# EAGLE design mosquino (EAGLE 6.2)
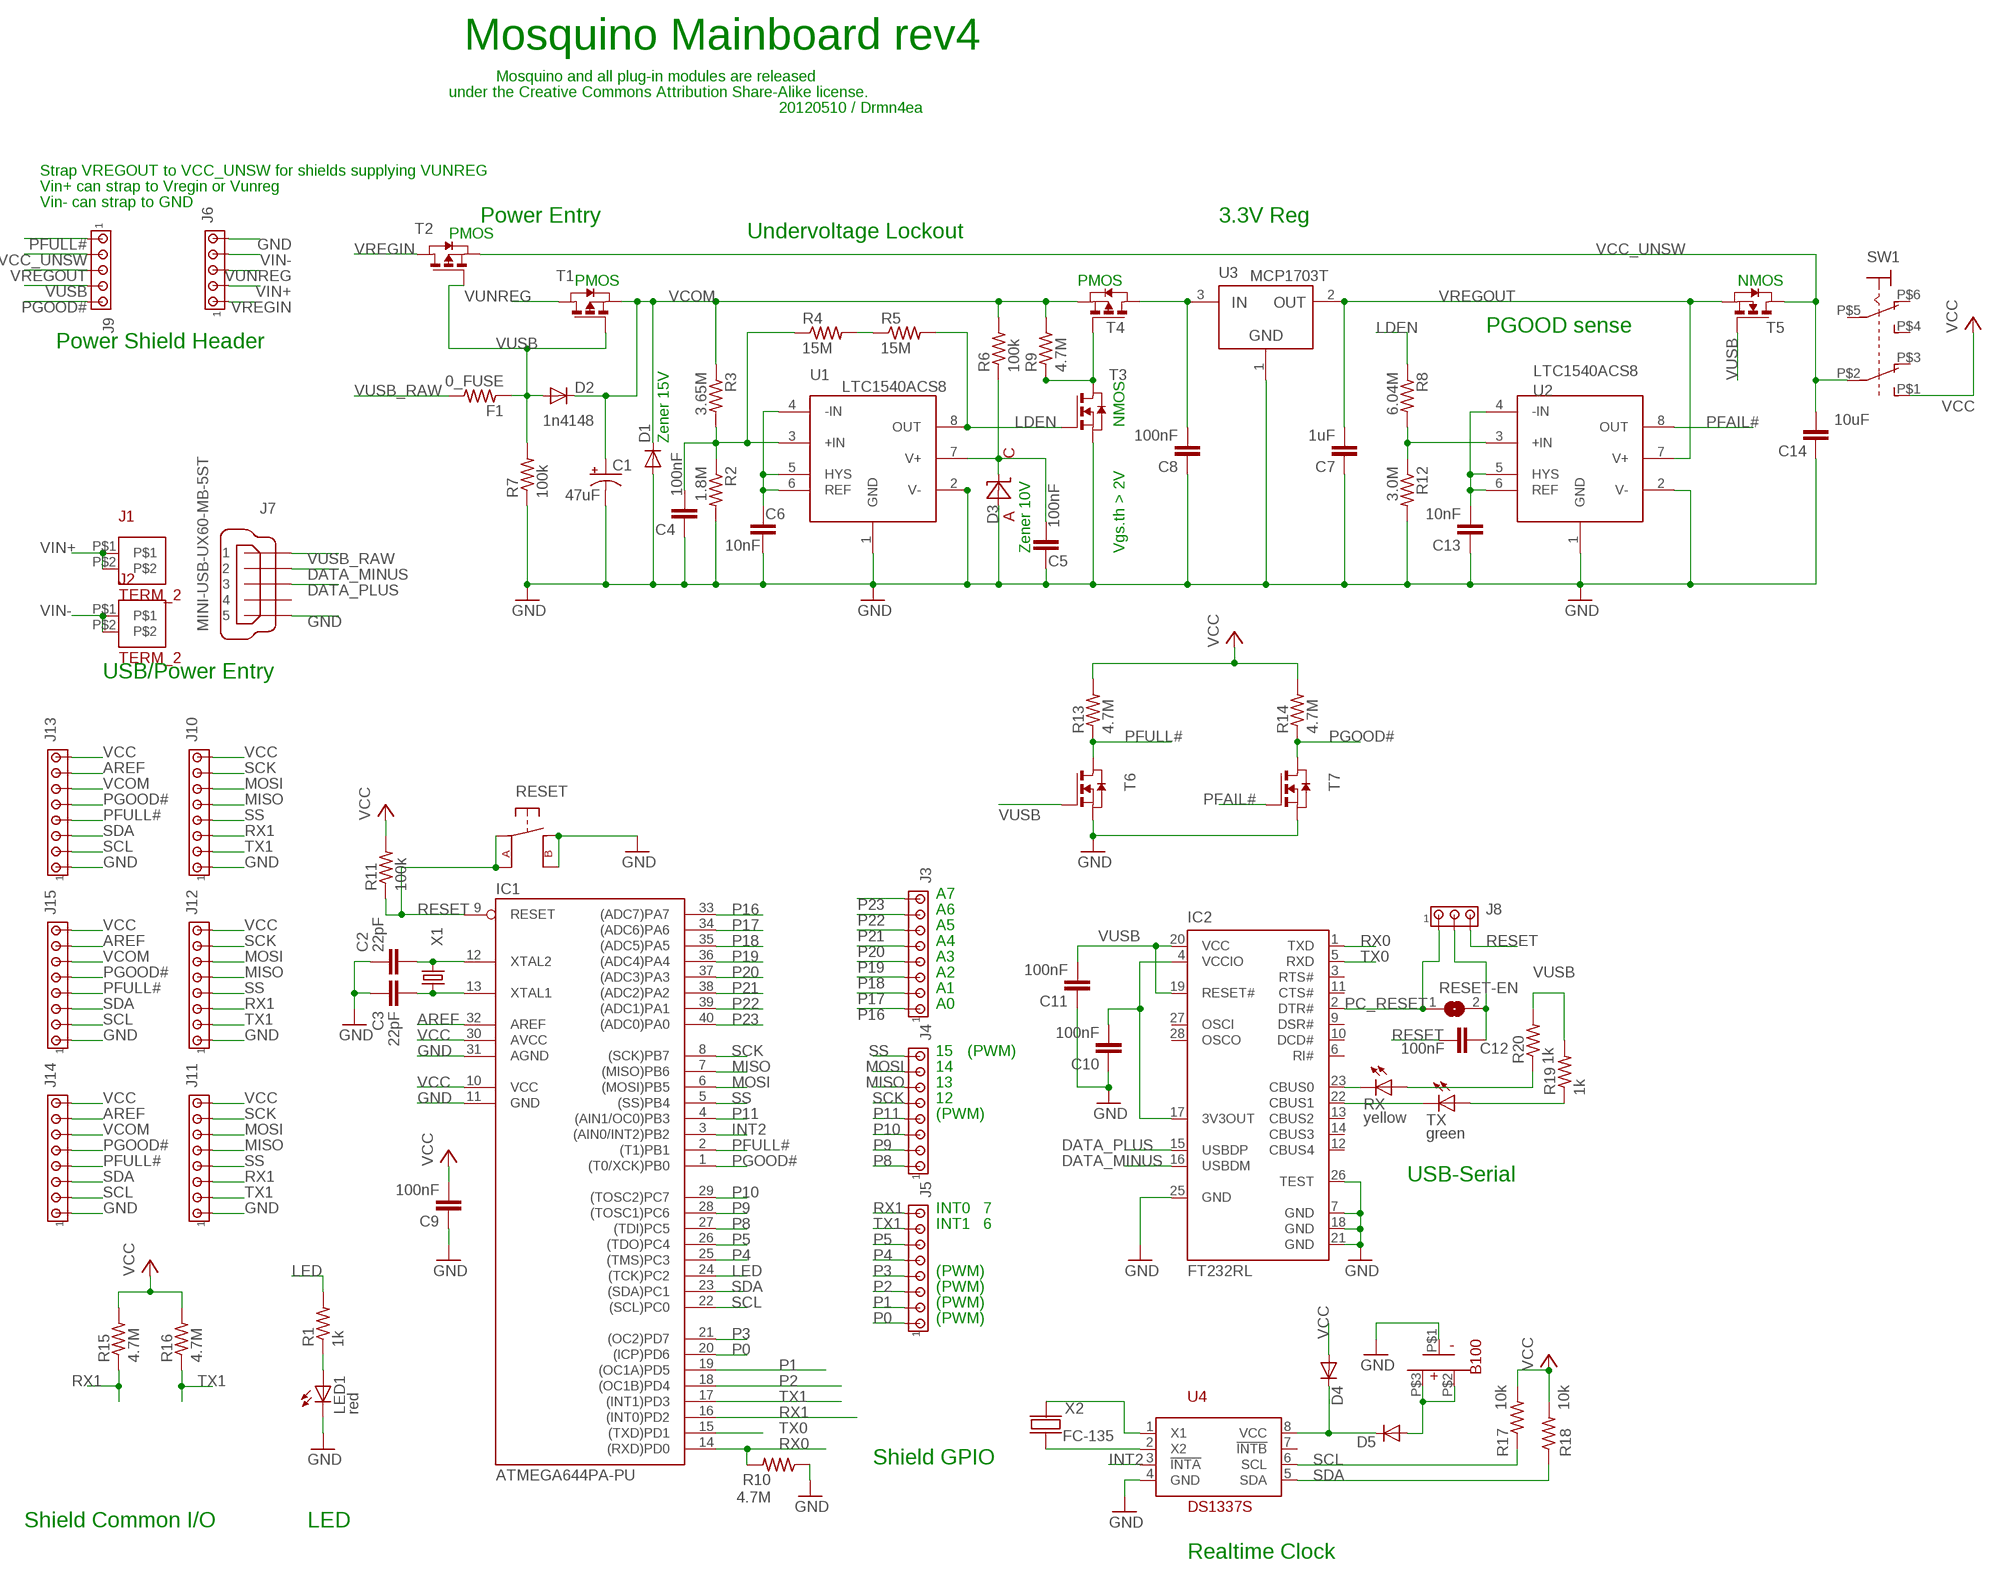
[diagram p0: schematic, sheet 1]

## Parts
B100  BK885_CR1225_COIN_BATTERY_HOLDER_SMD  [BK885_CR1225_COIN_BATTERY_HOLDER_SMD]
C1  47uF  CPOL-USD  [PANASONIC_D]
C2  22pF  C-EUC0805K  [C0805K]
C3  22pF  C-EUC0805K  [C0805K]
C4  100nF  C-EUC0805  [C0805]
C5  100nF  C-EUC0805  [C0805]
C6  10nF  C-EUC0805  [C0805]
C7  1uF  C-EUC0805  [C0805]
C8  100nF  C-EUC0805  [C0805]
C9  100nF  C-EUC0805K  [C0805K]
C10  100nF  C-EUC0805K  [C0805K]
C11  100nF  C-EUC0805K  [C0805K]
C12  100nF  C-EUC0805K  [C0805K]
C13  10nF  C-EUC0805  [C0805]
C14  10uF  C-EUC0805K  [C0805K]
D1  BZT52C15-7-F  DIODE-SOD123  [SOD123]
D2  1n4148  DIODE-SOD123  [SOD123]
D3  BZT52C10-7-F  DIODE_ZENER_CZRM27C200P-G  [SOD123]
D4  MMSD301T1G  DIODE-SOD123  [SOD123]
D5  MMSD301T1G  DIODE-SOD123  [SOD123]
F1  0_FUSE  R-US_R0805  [R0805]
IC1  ATMEGA644PA-PU  MEGA323-P  [DIL40]
IC2  FT232RL  [SSOP28]
J1  TERM_2  [TERM_3POINT5MM]
J2  TERM_2  [TERM_3POINT5MM]
J3  MTA08-100  [10X08MTA]
J4  MTA08-100  [10X08MTA]
J5  MTA08-100  [10X08MTA]
J6  MTA05-100  [10X05MTA]
J7  MINI-USB-UX60-MB-5ST  [UX60-MB-5ST]
J8  MTA03-100  [10X03MTA]
J9  MTA05-100  [10X05MTA]
J10  MTA08-100  [10X08MTA]
J11  MTA08-100  [10X08MTA]
J12  MTA08-100  [10X08MTA]
J13  MTA08-100  [10X08MTA]
J14  MTA08-100  [10X08MTA]
J15  MTA08-100  [10X08MTA]
LED1  red  LEDCHIP-LED0805  [CHIP-LED0805]
R1  1k  R-US_R0805  [R0805]
R2  1.8M  R-US_R0805  [R0805]
R3  3.65M  R-US_R0805  [R0805]
R4  15M  R-US_R0805  [R0805]
R5  15M  R-US_R0805  [R0805]
R6  100k  R-US_R0805  [R0805]
R7  100k  R-US_R0805  [R0805]
R8  6.04M  R-US_R0805  [R0805]
R9  4.7M  R-US_R0805  [R0805]
R10  4.7M  R-US_R0805  [R0805]
R11  100k  R-US_R0805  [R0805]
R12  3.0M  R-US_R0805  [R0805]
R13  4.7M  R-US_R0805  [R0805]
R14  4.7M  R-US_R0805  [R0805]
R15  4.7M  R-US_R0805  [R0805]
R16  4.7M  R-US_R0805  [R0805]
R17  10k  R-US_R0805  [R0805]
R18  10k  R-US_R0805  [R0805]
R19  1k  R-US_R0805  [R0805]
R20  1k  R-US_R0805  [R0805]
RESET  EVQ_TACT_SW_6X6POINT5  [EVQ_TACT_SW_6X6POINT5]
RESET-EN  SJ  [SJ]
RX  yellow  LEDCHIP-LED0805  [CHIP-LED0805]
SW1  SW_DPDT_EG1390  [EG1390_SWITCH_DPDT]
T1  DMP3098L-7  PMOSSOT23  [SOT-23]
T2  DMP3098L-7  PMOSSOT23  [SOT-23]
T3  IRFML8244TRPBF  NMOSSOT23  [SOT-23]
T4  DMP3098L-7  PMOSSOT23  [SOT-23]
T5  BSH103  NMOSSOT23  [SOT-23]
T6  IRFML8244TRPBF  NMOSSOT23  [SOT-23]
T7  IRFML8244TRPBF  NMOSSOT23  [SOT-23]
TX  green  LEDCHIP-LED0805  [CHIP-LED0805]
U1  LTC1540ACS8  [SO-8]
U2  LTC1540ACS8  [SO-8]
U3  MCP1703T  MCP1700T  [SOT23]
U4  DS1337S  [SO-8]
X1  ABLS-4.000MHZ-B4-T  CRYSTALSM49  [SM49]
X2  FC-135  [FC-135]

## Nets
AREF: IC1.32(AREF) J13.7 J14.7 J15.7
DATA_MINUS: IC2.16(USBDM) J7.2
DATA_PLUS: IC2.15(USBDP) J7.3
GND [pwr]: B100.P$1(-) C1.- C2.2 C3.1 C4.1 C5.1 C6.1 C7.1 C8.1 C9.1 C10.1 C11.1 C13.1 C14.1 D1.A D3.A IC1.11(GND) IC1.31(AGND) IC2.7(GND) IC2.18(GND) IC2.21(GND) IC2.25(GND) IC2.26(TEST) J6.5 J7.5 J10.1 J11.1 J12.1 J13.1 J14.1 J15.1 LED1.C R2.2 R7.1 R10.1 R12.2 RESET.B RESET.B2(B1) T3.2(S) T6.2(S) T7.2(S) U1.1(GND) U1.2(V-) U2.1(GND) U2.2(V-) U3.1(GND) U4.4(GND)
INT2: IC1.3((AIN0/INT2)PB2) U4.3(!INTA)
LDEN: R5.2 R8.1 T3.3(G) U1.8(OUT)
LED: IC1.24((TCK)PC2) R1.2
MISO: IC1.7((MISO)PB6) J4.6 J10.5 J11.5 J12.5
MOSI: IC1.6((MOSI)PB5) J4.7 J10.6 J11.6 J12.6
N$1: C12.1 J8.2 RESET-EN.2
N$2: C2.1 IC1.12(XTAL2) X1.2
N$3: LED1.A R1.1
N$4: IC2.22(CBUS1) TX.C
N$5: C3.2 IC1.13(XTAL1) X1.1
N$6: U4.2(X2) X2.P$2(X2)
N$7: D4.C D5.C U4.8(VCC)
N$8: U4.1(X1) X2.P$1(X1)
N$9: C10.2 IC2.4(VCCIO) IC2.17(3V3OUT)
N$10: R20.1 RX.A
N$11: C5.2 D3.C R6.1 U1.7(V+)
N$12: C6.2 U1.4(-IN) U1.5(HYS) U1.6(REF)
N$13: IC2.23(CBUS0) RX.C
N$14: R19.1 TX.A
N$15: B100.P$2(+) B100.P$3(+) D5.A
N$16: C4.2 R2.1 R3.2 R4.1 U1.3(+IN)
N$18: C13.2 U2.4(-IN) U2.5(HYS) U2.6(REF)
N$19: R8.2 R12.1 U2.3(+IN)
N$20 [pwr]: C8.2 T4.1(D) U3.3(IN)
N$21: R9.1 T3.1(D) T4.3(G)
N$22: R4.2 R5.1
P0: IC1.20((ICP)PD6) J5.1
P1: IC1.19((OC1A)PD5) J5.2
P2: IC1.18((OC1B)PD4) J5.3
P3: IC1.21((OC2)PD7) J5.4
P4: IC1.25((TMS)PC3) J5.5
P5: IC1.26((TDO)PC4) J5.6
P8: IC1.27((TDI)PC5) J4.1
P9: IC1.28((TOSC1)PC6) J4.2
P10: IC1.29((TOSC2)PC7) J4.3
P11: IC1.4((AIN1/OC0)PB3) J4.4
P16: IC1.33((ADC7)PA7) J3.1
P17: IC1.34((ADC6)PA6) J3.2
P18: IC1.35((ADC5)PA5) J3.3
P19: IC1.36((ADC4)PA4) J3.4
P20: IC1.37((ADC3)PA3) J3.5
P21: IC1.38((ADC2)PA2) J3.6
P22: IC1.39((ADC1)PA1) J3.7
P23: IC1.40((ADC0)PA0) J3.8
PC_RESET: IC2.2(DTR#) J8.1 RESET-EN.1
PFAIL#: T7.3(G) U2.8(OUT)
PFULL#: IC1.2((T1)PB1) J9.1 J13.4 J14.4 J15.4 R13.1 T6.1(D)
PGOOD#: IC1.1((T0/XCK)PB0) J9.5 J13.5 J14.5 J15.5 R14.1 T7.1(D)
RESET: C12.2 IC1.9(RESET) J8.3 R11.1 RESET.A RESET.A2(A1)
RX0: IC1.14((RXD)PD0) IC2.1(TXD) R10.2
RX1: IC1.16((INT0)PD2) J5.8 J10.3 J11.3 J12.3 R15.1
SCK: IC1.8((SCK)PB7) J4.5 J10.7 J11.7 J12.7
SCL: IC1.22((SCL)PC0) J13.2 J14.2 J15.2 R17.1 U4.6(SCL)
SDA: IC1.23((SDA)PC1) J13.3 J14.3 J15.3 R18.1 U4.5(SDA)
SS: IC1.5((SS)PB4) J4.8 J10.4 J11.4 J12.4
TX0: IC1.15((TXD)PD1) IC2.5(RXD)
TX1: IC1.17((INT1)PD3) J5.7 J10.2 J11.2 J12.2 R16.1
VCC [pwr]: C9.2 D4.A IC1.10(VCC) IC1.30(AVCC) J10.8 J11.8 J12.8 J13.8 J14.8 J15.8 R11.2 R13.2 R14.2 R15.2 R16.2 R17.2 R18.2 SW1.P$1(ON1)
VCC_UNSW [pwr]: C14.2 J9.2 SW1.P$2(COM1) T2.2(S) T5.1(D)
VCOM [pwr]: C1.+ D1.C D2.C J13.6 J14.6 J15.6 R3.1 R6.2 R9.2 T1.2(S) T4.2(S)
VIN+: J1.P$1 J1.P$2 J6.2
VIN-: J2.P$1 J2.P$2 J6.4
VREGIN [pwr]: J6.1 T2.1(D)
VREGOUT [pwr]: C7.2 J9.3 T5.2(S) U2.7(V+) U3.2(OUT)
VUNREG [pwr]: J6.3 T1.1(D)
VUSB [pwr]: C11.2 D2.A F1.1 IC2.19(RESET#) IC2.20(VCC) J9.4 R7.2 R19.2 R20.2 T1.3(G) T2.3(G) T5.3(G) T6.3(G)
VUSB_RAW: F1.2 J7.1
Unconnected: IC2.3(RTS#) IC2.6(RI#) IC2.9(DSR#) IC2.10(DCD#) IC2.11(CTS#) IC2.12(CBUS4) IC2.13(CBUS2) IC2.14(CBUS3) IC2.27(OSCI) IC2.28(OSCO) J7.4 SW1.P$3(OFF1) SW1.P$4(ON2) SW1.P$5(COM2) SW1.P$6(OFF2) U4.7(!INTB)

## Notes on the sheet
- Mosquino Mainboard rev4
- Mosquino and all plug-in modules are released
- under the Creative Commons Attribution Share-Alike license.
- 20120510 / Drmn4ea
- Strap VREGOUT to VCC_UNSW for shields supplying VUNREG
- Vin+ can strap to Vregin or Vunreg
- Vin- can strap to GND
- Power Entry | 3.3V Reg
- PMOS | Undervoltage Lockout
- PMOS | PMOS | NMOS
- PGOOD sense
- Power Shield Header
- NMOS
- Zener 15V
- Zener 10V | Vgs.th > 2V
- USB/Power Entry
- A7
- A6
- A5
- A4
- A3
- A2
- A1
- A0
- 15 | (PWM)
- 14
- 13
- 12
- (PWM)
- USB-Serial
- INT0 | 7
- INT1 | 6
- (PWM)
- (PWM)
- (PWM)
- (PWM)
- Shield GPIO
- Shield Common I/O | LED
- Realtime Clock

## Library data of the parts
B100 = tim:BK885_CR1225_COIN_BATTERY_HOLDER_SMD
C1 = rcl:CPOL-US: POLARIZED CAPACITOR, American symbol
C2-C14 = rcl:C-EU: CAPACITOR, European symbol
D1 D2 D4 D5 = diode:DIODE-: DIODE
D3 = mide_jeffcourt:DIODE_ZENER_CZRM27C200P-G: Zener Diode COMCHIP Part# CZRM27C200P www.comchiptech.com Package: MINI-SMA (SOD-123) //JCOURT 06/23/06
F1 R1-R20 = rcl:R-US_: RESISTOR, American symbol
IC1 = avr-4:MEGA323-P: MICROCONTROLLER 32 Kbytes FLASH 2 Kbytes SRAM 1 Kbytes EEPROM USART 8-channel 10 bit ADC
IC2 = ftdichip:FT232R: Source: http://www.ftdichip.com/Documents/DataSheets/DS_FT232R_v104.pdf
J1 J2 = tim:TERM_2
J3-J5 J10-J15 = con-amp:MTA08-100: AMP connector
J6 J9 = con-amp:MTA05-100: AMP connector
J7 = con-hirose:MINI-USB-: MINI USB Connector Source: http://www.hirose.co.jp/cataloge_hp/e24000019.pdf
J8 = con-amp:MTA03-100: AMP connector
LED1 RX TX = led:LED: LED OSRAM: - CHIPLED LG R971, LG N971, LY N971, LG Q971, LY Q971, LO R971, LY R971 LH N974, LH R974 LS Q976, LO Q976, LY Q976 LO Q996 - Hyper CHIPLED LW Q18S LB Q993, LB Q99A, LB R99A - SideLED LS A670, LO A670, LY A670, LG A670, LP A670 LB A673, LV A673, LT A673, LW A673 LH A674 LY A675 LS A676, LA A676, LO A676, LY A676, LW A676 LS A679, LY A679, LG A679 - Hyper Micro SIDELED® LS Y876, LA Y876, LO Y876, LY Y876 LT Y87S - SmartLED LW L88C, LW L88S LB L89C, LB L89S, LG L890 LS L89K, LO L89K, LY L89K LS L896, LA L896, LO L896, LY L896 - TOPLED LS T670, LO T670, LY T670, LG T670, LP T670 LSG T670, LSP T670, LSY T670, LOP T670, LYG T670 LG T671, LOG T671, LSG T671 LB T673, LV T673, LT T673, LW T673 LH T674 LS T676, LA T676, LO T676, LY T676, LB T676, LH T676, LSB T676, LW T676 LB T67C, LV T67C, LT T67C, LS T67K, LO T67K, LY T67K, LW E67C LS E67B, LA E67B, LO E67B, LY E67B, LB E67C, LV E67C, LT E67C LW T67C LS T679, LY T679, LG T679 LS T770, LO T770, LY T770, LG T770, LP T770 LB T773, LV T773, LT T773, LW T773 LH T774 LS E675, LA E675, LY E675, LS T675 LS T776, LA T776, LO T776, LY T776, LB T776 LHGB T686 LT T68C, LB T68C - Hyper Mini TOPLED® LB M676 - Mini TOPLED Santana® LG M470 LS M47K, LO M47K, LY M47K Source: http://www.osram.convergy.de/
RESET = tim:EVQ_TACT_SW_6X6POINT5: Panasonic EVQ series 6.5x6.0mm SMD tactile switch. 20100114 / tgipson
RESET-EN = jumper:SJ: SMD solder JUMPER
SW1 = tim:SW_DPDT_EG1390: E-Switch EG1390x DPDT micro SMD switch. Pin numbering is nonstandard, as in datasheet! 20100106 / tgipson
T1 T2 T4 = zetex:PMOSSOT23: MOS FET
T3 T5-T7 = zetex:NMOSSOT23: MOS FET
U1 U2 = mideeval:LTC1540A: LTC1540A Comparator, Rectangular Symbol, S08 Package JR 9.18.03
U3 = mideeval:MCP1700T: Voltage regulator in SOT23. 20060228 / tgipson
U4 = tim:DS1337
X1 = crystal:CRYSTAL: CRYSTAL
X2 = tim:FC-135

## Net classes
0 default: width 0.203 mm, drill 0.381 mm
1 pwr: width 0.406 mm, drill 0.381 mm, clearance 0.203 mm
4 digital: width 0.203 mm, drill 0.381 mm, clearance 0.203 mm

## Board
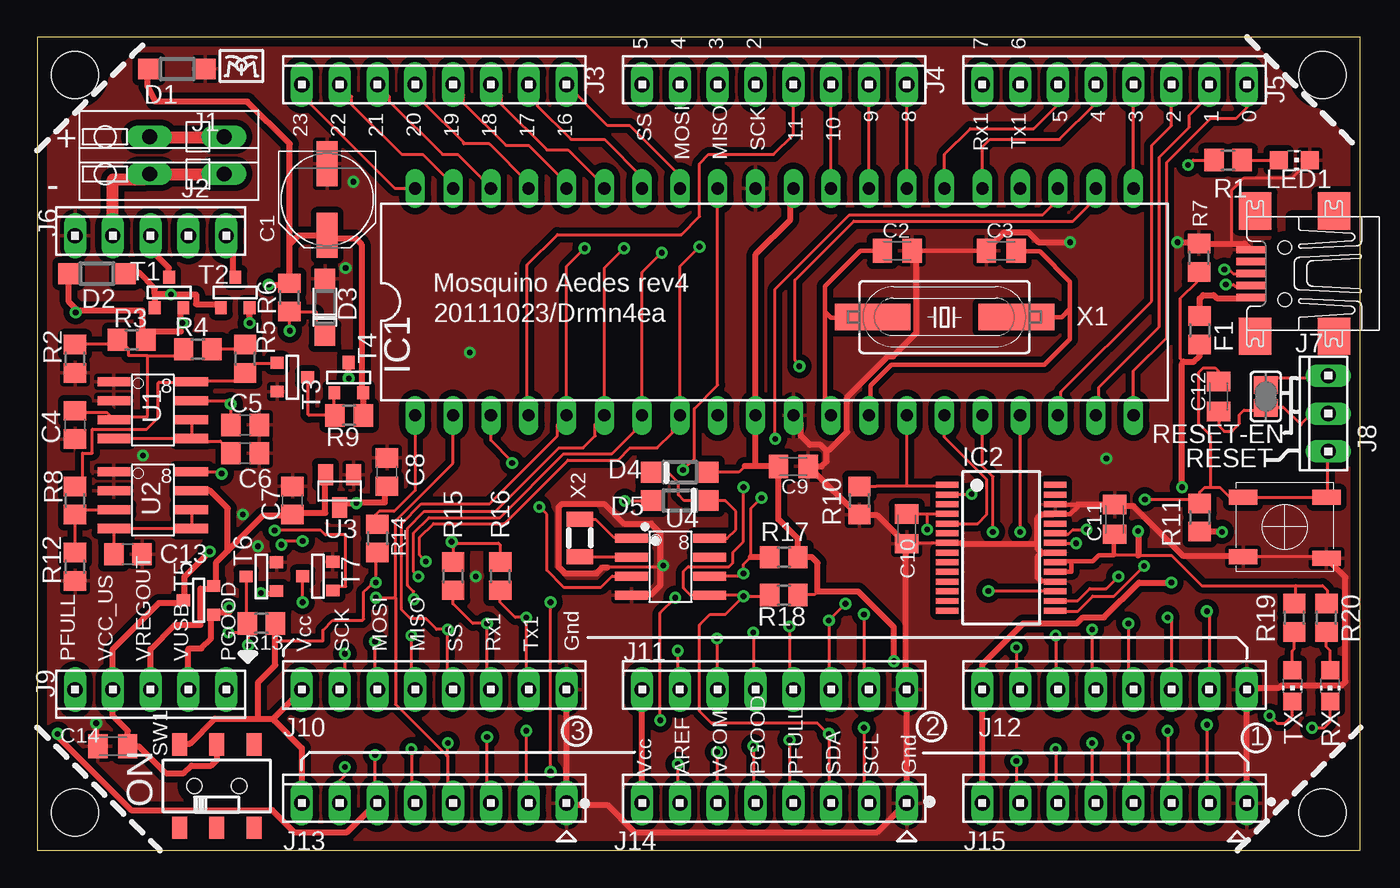
[diagram p1: board, top side]
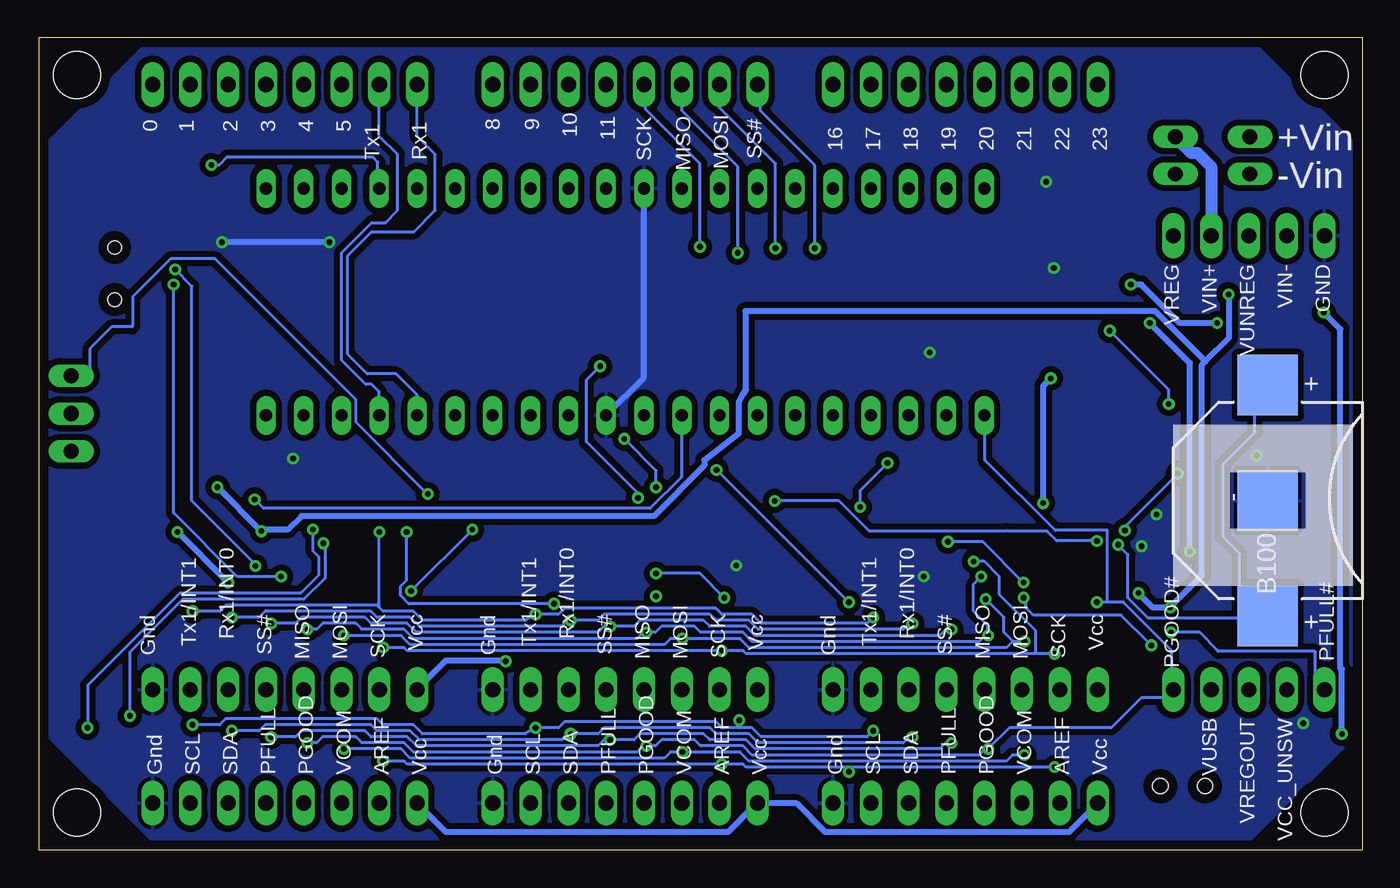
[diagram p2: board, bottom side, seen from below]

Size 88.9 x 54.61 mm. Coordinates in mm from the lower left corner, seen from the top.
Outline: 0,0 88.9,0 88.9,54.61 0,54.61 0,0
Copper layers (1*16): Top 0.035mm / dielectric 1.5mm / Bottom 0.035mm
Design rules: minimum track width 8mil, minimum drill 15mil, track to track 8mil, track to pad 8mil, pad to pad 8mil, via to via 8mil, smd to smd 8mil, copper to edge 25mil, drill to drill 8mil, minimum pad ring 10mil, minimum via ring 8mil, stop-mask expansion 4mil, vias tented up to drill 0mil, thermal gap 10mil
Holes 3.17 mm at 2.54,52.07 86.36,52.07 86.36,2.54 2.54,2.54

### Footprints (pad centres in the part's own frame; a part is rotated, then mirrored left to right if it is on the bottom)
BK885_CR1225_COIN_BATTERY_HOLDER_SMD = smd 4.064 x 4.064: P$1 0,0; P$2 -7.747,0; P$3 7.747,0
PANASONIC_D = smd 3 x 1.4: + 2.4,0; - -2.4,0
C0805K = smd 1.3 x 1.6: 1 -1,0; 2 1,0
C0805 = smd 1.3 x 1.5: 1 -0.95,0; 2 0.95,0
SOD123 = smd 1.4 x 1.4: A 1.9,0; C -1.9,0
R0805 = smd 1.3 x 1.5: 1 -0.95,0; 2 0.95,0
DIL40 = drill 0.813 long: 1 -24.13,-7.62; 2 -21.59,-7.62; 3 -19.05,-7.62; 4 -16.51,-7.62; 5 -13.97,-7.62; 6 -11.43,-7.62; 7 -8.89,-7.62; 8 -6.35,-7.62; 9 -3.81,-7.62; 10 -1.27,-7.62; 11 1.27,-7.62; 12 3.81,-7.62; 13 6.35,-7.62; 14 8.89,-7.62; 15 11.43,-7.62; 16 13.97,-7.62; 17 16.51,-7.62; 18 19.05,-7.62; 19 21.59,-7.62; 20 24.13,-7.62; 21 24.13,7.62; 22 21.59,7.62; 23 19.05,7.62; 24 16.51,7.62; 25 13.97,7.62; 26 11.43,7.62; 27 8.89,7.62; 28 6.35,7.62; 29 3.81,7.62; 30 1.27,7.62; 31 -1.27,7.62; 32 -3.81,7.62; 33 -6.35,7.62; 34 -8.89,7.62; 35 -11.43,7.62; 36 -13.97,7.62; 37 -16.51,7.62; 38 -19.05,7.62; 39 -21.59,7.62; 40 -24.13,7.62
SSOP28 = smd 0.4 x 1.5: 1 -4.225,-3.625; 2 -3.575,-3.625; 3 -2.925,-3.625; 4 -2.275,-3.625; 5 -1.625,-3.625; 6 -0.975,-3.625; 7 -0.325,-3.625; 8 0.325,-3.625; 9 0.975,-3.625; 10 1.625,-3.625; 11 2.275,-3.625; 12 2.925,-3.625; 13 3.575,-3.625; 14 4.225,-3.625; 15 4.225,3.625; 16 3.575,3.625; 17 2.925,3.625; 18 2.275,3.625; 19 1.625,3.625; 20 0.975,3.625; 21 0.325,3.625; 22 -0.325,3.625; 23 -0.975,3.625; 24 -1.625,3.625; 25 -2.275,3.625; 26 -2.925,3.625; 27 -3.575,3.625; 28 -4.225,3.625
TERM_3POINT5MM = drill 1 long: P$1 0,2.5; P$2 0,-2.5
10X08MTA = drill 1.016 long: 1 8.89,0; 2 6.35,0; 3 3.81,0; 4 1.27,0; 5 -1.27,0; 6 -3.81,0; 7 -6.35,0; 8 -8.89,0
10X05MTA = drill 1.016 long: 1 5.08,0; 2 2.54,0; 3 0,0; 4 -2.54,0; 5 -5.08,0
UX60-MB-5ST = smd 2 x 0.5: 1 2.25,1.6; 2 2.25,0.8; 3 2.25,0; 4 2.25,-0.8; 5 2.25,-1.6 | smd 2.2 x 2.5: M1 -3.3,-4.2; M2 -3.3,4.2; M3 2,4.2; M4 2,-4.2 | hole 0.9: 0,-1.75; 0,1.75
10X03MTA = drill 1.016 long: 1 2.54,0; 2 0,0; 3 -2.54,0
CHIP-LED0805 = smd 1.2 x 1.2: A 0,-1.05; C 0,1.05
EVQ_TACT_SW_6X6POINT5 = smd 1.9 x 1: A -2.8,-2; A2 2.8,-2; B -2.8,2.1; B2 2.8,2
SJ = smd 1.168 x 1.6: 1 -0.762,0; 2 0.762,0
EG1390_SWITCH_DPDT = smd 1 x 1.5: P$1 -2.5,2.8; P$2 0,2.8; P$3 2.5,2.8; P$4 -2.5,-2.8; P$5 0,-2.8; P$6 2.5,-2.8 | hole 1.016: -1.5,0; 1.5,0
SOT-23 = smd 0.787 x 0.889: 1 0.025,-1.016; 2 -0.94,1.016; 3 0.991,1.016
SO-8 = smd 0.61 x 2.21: 1 -1.905,-2.616; 2 -0.635,-2.616; 3 0.635,-2.616; 4 1.905,-2.616; 5 1.905,2.616; 6 0.635,2.616; 7 -0.635,2.616; 8 -1.905,2.616
SOT23 = smd 1 x 1.4: 1 -0.95,-1.1; 2 0.95,-1.1; 3 0,1.1
SM49 = smd 5.08 x 1.778: 1 -4.826,0; 2 4.826,0
FC-135 = smd 1 x 1.8: P$1 0,0; P$2 2.5,0

### Placement (x,y rotation side)
B100  6.35,23.5 270 bottom
C1  19.48,43.71 270 top
C2  57.78,40.26 0 top
C3  64.77,40.26 0 top
C4  2.54,28.57 90 top
C5  13.97,28.57 180 top
C6  13.97,26.67 180 top
C7  17.14,23.5 270 top
C8  23.5,25.4 270 top
C9  50.8,25.78 180 top
C10  58.42,21.59 90 top
C11  72.39,22.23 270 top
C12  79.38,30.48 90 top
C13  6.1,19.89 180 top
C14  5.08,6.99 0 top
D1  9.4,52.48 0 top
D2  4.01,38.73 0 top
D3  19.33,36.47 90 top
D4  43.18,25.4 0 top
D5  43.18,23.5 180 top
F1  78.11,34.92 90 top
IC1  49.53,36.83 0 top
IC2  64.77,20.32 270 top
J1  10.05,47.92 90 top
J2  10.05,45.42 90 top
J3  26.67,51.44 0 top
J4  49.53,51.44 0 top
J5  72.39,51.44 0 top
J6  7.62,41.27 0 top
J7  83.82,38.73 180 top
J8  86.74,29.34 90 top
J9  7.62,10.79 180 top
J10  26.67,10.79 0 top
J11  49.53,10.79 0 top
J12  72.39,10.79 0 top
J13  26.67,3.17 0 top
J14  49.53,3.17 0 top
J15  72.39,3.17 0 top
LED1  84.45,46.35 270 top
R1  80.01,46.35 180 top
R2  2.54,33.02 270 top
R3  6.35,34.29 180 top
R4  10.79,33.66 0 top
R5  13.97,33.02 270 top
R6  16.94,37.13 90 top
R7  78.05,39.8 270 top
R8  2.54,23.5 270 top
R9  20.95,29.21 0 top
R10  55.24,23.5 90 top
R11  78.11,22.35 270 top
R12  2.54,19.05 270 top
R13  15.06,15.24 0 top
R14  22.86,20.95 270 top
R15  27.94,18.41 90 top
R16  31.11,18.41 90 top
R17  50.16,19.68 0 top
R18  50.16,17.14 0 top
R19  84.45,15.62 90 top
R20  86.61,15.62 90 top
RESET  83.82,21.72 180 top
RESET-EN  82.55,30.48 270 top
RX  86.87,11.05 180 top
SW1  12.06,4.32 0 top
T1  8.89,37.47 180 top
T2  13.34,37.47 180 top
T3  17.14,31.75 90 top
T4  20.95,31.75 180 top
T5  10.85,16.81 270 top
T6  15.06,18.41 270 top
T7  18.85,18.44 270 top
TX  84.33,11.05 180 top
U1  7.77,29.57 270 top
U2  7.77,23.52 270 top
U3  20.32,24.13 180 top
U4  42.55,19.05 270 top
X1  60.96,35.81 180 top
X2  36.45,22.23 270 top

### Tracks (layer width: path | path; a pad name or v marks a point on that pad's centre or on a via)
AREF  (via drill 0.38)
  Top 0.203: J13.7 20.32,4.67 20.68,5.03 v20.68,5.59 | J14.7 43.03,3.33 v43.03,5.79 | J15.7 65.79,3.43 v65.79,5.99 | IC1.32 45.72,31.24 44.15,29.67 44.15,26.31 v43.38,25.55 | v34.49,5.28 v34.49,16.66
  Bottom 0.203: v65.79,5.99 64.36,5.99 64.16,5.79 v43.03,5.79 41.6,5.79 41.4,5.59 34.49,5.59 | v20.68,5.59 34.49,5.59 | v34.49,16.66 v43.38,25.55 | 34.49,5.59 v34.49,5.28
DATA_MINUS  (via drill 0.38)
  Top 0.203: IC2.16 68.41,16.76 69.9,16.76 70.71,17.58 71.83,17.58 v72.64,18.39 | J7.2 81.53,37.9 80.47,37.9 80.37,38 v79.86,38
  Bottom 0.203: v79.86,38 79.86,22.66 75.59,18.39 v72.64,18.39
DATA_PLUS  (via drill 0.38)
  Top 0.203: IC2.15 68.44,16.05 69.9,16.05 70.92,17.07 72.34,17.07 v74.37,19.1 | J7.3 81.55,38.71 80.37,38.71 80.06,39.01 v79.76,39.01
  Bottom 0.203: v79.76,39.01 78.64,37.9 78.64,23.47 74.47,19.3 v74.37,19.1
GND  (via drill 0.38)
  Top 0.203: 38.3,19 38.41,19.05 41.78,19.05 | RESET.B 86.52,19.72 RESET.B2 | C10.1 58.48,20.64 IC2.7 | 85.5,46.33 84.33,45.16 81.08,45.16 80.26,44.35 80.26,40.74
  Top 0.305: C2.2 C3.1 | 67.46,18.09 68.38,18.09 IC2.18 | 67.46,19.96 68.38,19.96 IC2.21 | IC2.26 68.63,23.22 69.9,23.22 69.9,23.06 69.39,22.55 68.48,22.55 68.43,22.61 | 62.08,20.62 61.21,20.62 IC2.7
  Top 0.406: C14.1 3.96,7.1 v3.96,8.53 3.86,8.69 | IC1.11 51.31,28.7 51.31,27.84 51.92,27.23 52.63,27.23 53.03,26.82 | 53.03,26.82 53.03,26.11 52.7,25.78 C9.1 52.02,25.6 54.97,22.66 55.07,22.66 R10.1 55.27,22.5 56.44,22.5 58.37,20.57 C10.1 58.37,20.37 58.37,10.97 J11.1 J14.1 58.27,3.05 56.44,1.22 40.13,1.22 38.3,3.05 35.71,3.05 J13.1 J10.1 35.66,10.97 | U4.4 39.95,17.17 41.25,17.17 41.86,17.78 41.86,19.07 | 41.86,19.07 41.86,21.34 41.25,21.95 39.42,21.95 38.1,23.27 35.26,23.27 35.05,23.06 35.05,19 35.46,18.59 37.59,18.59 38,19 38.3,19 | v42.06,19.13 42.01,19.07 41.86,19.07 | J15.1 J12.1 81.43,10.92 83.46,10.92 83.62,11.07 87.63,11.07 87.88,11.33 87.88,18.34 86.67,19.56 RESET.B | 67.46,18.09 67.21,18.34 67.21,19.71 67.46,19.96 67.36,20.12 67.21,20.27 67.21,20.57 | 69.9,23.22 72.39,23.22 C11.1 72.54,23.11 73.66,23.11 77.01,19.76 80.92,19.76 RESET.B2 | 67.21,20.57 67.21,22.3 67.46,22.55 68.22,22.55 IC2.25 | J7.5 81.53,40.34 81.13,40.74 80.26,40.74 78.08,40.74 R7.1 77.88,40.84 v76.61,40.84 | 85.5,46.33 LED1.C | C2.2 59.08,40.13 59.08,34.75 57.51,33.17 57.15,33.17 54.41,30.43 54.41,28.09 53.19,26.87 53.03,26.82 | v69.39,40.84 67.26,40.84 66.6,41.5 64.97,41.5 63.86,40.39 C3.1 | 62.08,20.62 62.13,20.57 67.21,20.57
  Bottom 0.406: IC1.31 48.26,31.75 IC1.11 | v69.39,40.84 v76.61,40.84
  other vias: 7.11,26.52 20.73,39.12 21.23,44.91 13.82,22.56 14.83,20.42 29.06,33.43 29.46,18.39 71.83,26.31
  pour Bottom (isolate 0.406): 0,46.91 -0.03,8.2 8.18,0 80.67,0 88.9,8.23 88.9,46.99 81.28,54.61 7.65,54.61 0.03,46.99
  pour Top (isolate 0.406): 7.62,54.61 0,46.99 0,8.26 8.26,0 80.64,0 88.9,8.26 88.9,46.99 81.28,54.61
INT2  (via drill 0.38)
  Top 0.203: IC1.3 30.48,27.53 31.9,26.11 v31.9,26.01 | v33.73,23.06 34.24,22.55 34.24,18.8 35.36,17.68 37.9,17.68 38.63,18.41 U4.3
  Bottom 0.203: v31.9,26.01 33.73,24.18 v33.73,23.06
LDEN
  Top 0.203: T3.3 16.1,32.72 14.58,32.72 13.97,32.11 R5.2 13.92,32 13.77,32 13.31,31.55 10.41,31.55 U1.8 10.36,31.45 8.18,31.45 8.13,31.39 8.13,29.06 7.37,28.3 3.71,28.3 3.71,26.67 3.05,26.67 3.05,24.99 2.54,24.49 R8.1
LED  (via drill 0.38)
  Top 0.203: v77.32,46.02 77.65,46.35 R1.2
  Bottom 0.203: IC1.24 66.14,44.55 66.14,46.23 66.45,46.53 76.3,46.53 76.81,46.02 v77.32,46.02
MISO  (via drill 0.38)
  Top 0.203: v41.96,40.13 40.64,38.81 IC1.7 40.13,28.7 40.13,28.14 38.61,26.62 35.36,26.62 31.09,22.35 26.31,22.35 25.3,21.34 25.3,18.69 v25.6,18.39 | J12.5 70.87,11.05 v70.87,14.83 | J11.5 48.11,10.95 v48.11,14.63 | J10.5 25.15,11.05 v25.15,14.43
  Bottom 0.203: 71.07,14.83 v70.87,14.83 70.26,14.83 69.85,15.24 67.61,15.24 67.21,14.83 64.36,14.83 63.75,14.22 48.72,14.22 48.31,14.63 v48.11,14.63 47.5,14.63 47.09,15.04 44.86,15.04 44.45,14.63 41.6,14.63 41,14.02 25.76,14.02 25.35,14.43 v25.15,14.43 25.15,15.09 26.11,16.05 26.11,17.88 v25.6,18.39 | J4.6 45.72,49.68 41.96,45.92 v41.96,40.13
MOSI  (via drill 0.38)
  Top 0.203: v39.42,40.44 38.1,39.12 IC1.6 37.49,28.6 37.49,27.84 36.68,27.03 35.05,27.03 30.79,22.76 26.01,22.76 24.89,21.64 24.89,17.78 25.3,17.37 v25.3,16.87 | J12.6 68.43,10.95 v68.43,14.43 | J11.6 45.67,10.85 v45.67,14.22 | J10.6 22.71,10.95 v22.71,14.02
  Bottom 0.203: 23.52,14.02 23.93,13.61 41.2,13.61 41.81,14.22 v45.67,14.22 46.48,14.22 46.89,13.82 63.96,13.82 64.57,14.43 v68.43,14.43 | v22.71,14.02 23.52,14.02 | J4.7 43.18,49.89 39.42,46.13 v39.42,40.44 | v25.3,16.87 24.08,15.65 24.08,14.63 23.52,14.07 23.52,14.02
N$1
  Top 0.203: 84.89,28.6 83.72,29.77 82.6,29.77 RESET-EN.2 82.4,29.57 81.08,29.57 80.77,29.26 80.77,28.65 80.26,28.14 79.76,28.14 79.38,28.52 C12.1 | 84.89,28.6 84.91,28.57 | J8.2 86.72,29.31 85.6,29.31 84.89,28.6
N$2
  Top 0.305: X1.2 56.08,35.76 53.34,35.76 52.93,36.17 | 52.93,36.17 52.93,37.9 55.3,40.26 C2.1 | IC1.12 52.93,29.62 52.93,36.17
N$3
  Top 0.203: R1.1 LED1.A
N$4  (via drill 0.38)
  Top 0.203: IC2.22 68.42,20.62 v69.8,20.62 | v82.8,9.04 83.31,8.53 83.82,8.53 84.33,9.04 TX.C
  Bottom 0.203: v69.8,20.62 69.7,20.52 69.7,18.29 71.12,16.87 79.25,16.87 82.8,13.31 v82.8,9.04
N$5
  Top 0.305: C3.2 65.8,40.23 67.36,40.23 69.39,38.2 69.39,36.37 | 69.39,36.37 68.83,35.81 X1.1 | IC1.13 55.98,29.31 55.98,31.19 57.4,32.61 67.67,32.61 69.39,34.34 69.39,36.37
N$6
  Top 0.203: U4.2 39.89,19.73 X2.P$2
N$7
  Top 0.203: D4.C 42.37,25.4 43.08,24.69 43.08,23.88 43.46,23.5 D5.C | 45.1,23.47 46.23,23.47 46.94,22.76 46.94,21.54 46.35,20.95 U4.8
  Top 0.305: 45.1,23.47 D5.C
N$8
  Top 0.203: U4.1 39.85,21.03 38.71,21.03 37.52,22.23 X2.P$1
N$9  (via drill 0.38)
  Top 0.203: IC2.4 59.79,22.59 | C10.2 59.79,22.59 | v63.91,17.42 68.38,17.42 IC2.17 | 59.79,22.59 v59.79,21.54
  Bottom 0.203: v59.79,21.54 v63.91,17.42
N$10
  Top 0.203: RX.A 86.87,13.41 86.61,13.66 R20.1
N$11  (via drill 0.38)
  Top 0.203: D3.C 19.3,34.59 18.75,35.15 18.75,36.17 16.97,36.17 R6.1 16.97,36.07 v16.97,34.9 | 13.01,28.6 C5.2 13.01,28.7 v13.01,29.97 13.01,30.2 U1.7
  Bottom 0.203: v16.97,34.9 13.01,30.94 v13.01,29.97
N$12
  Top 0.203: C6.2 13.01,26.67 13.01,26.77 12.29,27.48 10.57,27.48 U1.5 | U1.4 5.18,27.69 10.31,27.69 U1.5 | U1.6 10.41,28.91 10.41,27.74 U1.5
N$13  (via drill 0.38)
  Top 0.203: IC2.23 68.44,21.34 69.09,21.34 69.19,21.23 69.29,21.23 69.6,21.54 v70.51,21.54 | v85.65,8.23 86.46,8.23 86.87,8.64 RX.C
  Bottom 0.203: v70.51,21.54 70.51,20.12 70.1,19.71 70.1,18.49 71.32,17.27 79.45,17.27 85.65,11.07 v85.65,8.23
N$14
  Top 0.203: TX.A 84.33,13.41 84.45,13.54 R19.1
N$15  (via drill 0.38)
  Top 0.203: v39.47,23.47 41.25,23.47 D5.A | v17.83,20.78 16.46,20.78 16.41,20.73 v16.41,20.52
  Bottom 0.203: v39.47,23.47 35.15,23.47 33.12,21.44 23.93,21.44 23.88,21.49 23.82,21.44 21.18,21.44 20.52,20.78 v17.83,20.78 | B100.P$2 7.21,30.38 7.21,28.09 9.35,25.96 9.35,21.03 8.23,19.91 8.23,17.63 B100.P$3 6.4,15.7 6.4,15.6 14.38,15.6 15.75,16.97 15.75,19.86 v16.41,20.52
N$16
  Top 0.203: C4.2 2.79,29.41 4.67,29.41 U1.3 5.23,28.96 5.99,28.96 6.15,29.11 7.37,29.11 7.42,29.16 7.42,33.22 | R2.1 2.54,33.98 5.08,33.98 5.38,34.29 R3.2 5.49,34.34 6.15,33.68 6.15,33.22 7.42,33.22 | 7.42,33.22 9.3,33.22 9.7,33.63 9.8,33.63 R4.1
  Top 0.406: C4.2 2.6,29.46
N$18
  Top 0.203: C13.2 5.18,19.91 5.18,21.59 U2.4 5.23,21.64 10.31,21.64 U2.5 10.41,21.64 10.41,22.86 U2.6
N$19
  Top 0.203: R12.1 R8.2 2.59,22.61 2.85,22.86 5.13,22.86 U2.3
N$20  (via drill 0.38)
  Top 0.203: 20.57,23.32 20.32,23.06 U3.3 | 23.37,23.93 23.37,24.43 23.47,24.43 C8.2 | v21.44,23.32 21.49,23.37
  Top 0.406: v20.93,31.7 T4.1 | 20.57,23.32 v21.44,23.32 | 23.37,23.93 23.37,23.37 21.49,23.37
  Bottom 0.406: v20.93,31.7 21.44,31.19 v21.44,23.32
N$21
  Top 0.203: T3.1 18.19,31.75 18.19,29.26 18.24,29.21 R9.1 19.96,29.26 T4.3
N$22
  Top 0.203: R4.2 11.79,33.68 13.72,33.68 13.97,33.93 R5.1
P0
  Top 0.203: IC1.20 73.66,32.21 75.89,34.44 75.89,46.23 78.84,49.17 80.57,49.17 81.28,49.89 J5.1
P1
  Top 0.203: IC1.19 71.32,29.41 71.32,31.09 75.39,35.15 75.39,46.53 77.42,48.56 77.42,49.38 78.74,50.7 J5.2
P2
  Top 0.203: IC1.18 68.78,29.41 68.78,30.79 74.88,36.88 74.88,47.35 76.2,48.67 J5.3
P3
  Top 0.203: IC1.21 J5.4
P4
  Top 0.203: IC1.25 63.5,47.24 64.01,47.75 68.68,47.75 71.12,50.19 J5.5
P5
  Top 0.203: IC1.26 60.96,46.74 62.69,48.46 66.95,48.46 68.58,50.09 J5.6
P8
  Top 0.203: IC1.27 J4.1
P9
  Top 0.203: IC1.28 J4.2
P10
  Top 0.203: IC1.29 J4.3
P11
  Top 0.203: IC1.4 32.92,29.31 32.92,39.32 34.95,41.35 43.28,41.35 44.5,42.57 44.5,46.13 45.11,46.74 49.48,46.74 50.8,48.06 J4.4
P16
  Top 0.203: J3.1 38.33,48.67 39.83,48.67 43.18,45.31 IC1.33
P17
  Top 0.203: J3.2 33.63,50.83 33.63,49.99 35.87,47.75 38.1,47.75 40.64,45.21 IC1.34
P18
  Top 0.203: J3.3 31.19,50.72 31.19,50.09 34.24,47.04 35.66,47.04 38.1,44.6 IC1.35
P19
  Top 0.203: J3.4 28.65,50.72 28.65,50.19 31.5,47.35 33.02,47.35 35.56,44.81 IC1.36
P20
  Top 0.203: J3.5 26.01,50.83 26.01,50.19 28.65,47.55 28.65,47.45 30.38,47.45 33.02,44.81 IC1.37
P21
  Top 0.203: J3.6 23.67,50.62 23.67,50.29 27.23,46.74 28.25,46.74 30.48,44.5 IC1.38
P22
  Top 0.203: J3.7 21.13,50.62 21.13,50.09 24.49,46.74 25.91,46.74 27.94,44.7 IC1.39
P23
  Top 0.203: J3.8 18.39,50.83 18.39,50.09 24.03,44.45 IC1.40
PC_RESET  (via drill 0.38)
  Top 0.203: RESET-EN.1 82.68,31.11 | RESET-EN.1 82.5,31.19 | v62.79,23.93 61.16,23.93 IC2.2 | RESET-EN.1 82.7,31.19 83.21,31.7 86.56,31.7 J8.1
  Bottom 0.203: v62.79,23.93 67.61,28.75 67.61,30.28 77.06,39.73 80.06,39.73 82.6,37.19 82.6,35.26 82.65,35.2 82.65,35.15 84.02,35.15 85.5,33.68 85.5,31.9 86.72,31.9 J8.1
PFAIL#  (via drill 0.38)
  Top 0.203: T7.3 19.86,17.48 19.96,17.48 20.22,17.73 20.73,17.73 20.73,21.18 19.36,21.18 19.05,21.49 v15.95,21.49 | v12.39,25.3 12.39,25.4 10.41,25.4 U2.8
  Bottom 0.203: v12.39,25.3 15.95,21.74 v15.95,21.49
PFULL#  (via drill 0.38)
  Top 0.203: J13.4 27.58,3.53 27.58,6.35 | 27.58,6.35 v27.58,7.21 | J14.4 50.55,3.43 v50.55,7.42 | J15.4 73.3,3.53 v73.3,7.62 | IC1.2 27.94,26.01 24.08,22.15 24.08,16.97 | 24.08,16.97 24.08,9.8 27.53,6.35 27.58,6.35 | v22.76,16.97 24.08,16.97 | T6.1 14.07,18.39 14.07,15.24 R13.1 | v14.17,13.77 14.17,15.19 R13.1 | v12.85,14.63 14.12,14.63 R13.1
  Bottom 0.203: v73.3,7.62 71.68,7.62 71.27,8.03 67,8.03 66.6,7.62 64.16,7.62 63.55,7.01 51.36,7.01 50.95,7.42 v50.55,7.42 48.92,7.42 48.51,7.82 44.25,7.82 43.84,7.42 41.4,7.42 40.79,6.81 28.4,6.81 27.99,7.21 v27.58,7.21 | v14.17,13.77 16.2,15.8 22.1,15.8 22.61,16.31 22.61,17.02 v22.76,16.97 | v12.85,14.63 10.92,14.63 9.7,13.41 9.7,13.36 3.2,13.36 3.15,13.31 3.15,11.43 2.54,10.82 J9.1
PGOOD#  (via drill 0.38)
  Top 0.203: J13.5 25.15,3.43 v25.15,6.81 | J14.5 48.11,3.33 v48.11,7.01 | J15.5 70.87,3.43 v70.87,7.21 | v17.83,16.66 T7.1 | R14.1 22.76,22.01 22.76,22.55 22.96,22.76 23.98,22.76 25.4,24.18 IC1.1
  Bottom 0.203: 71.07,7.21 v70.87,7.21 70.26,7.21 69.85,7.62 67.61,7.62 67.21,7.21 64.36,7.21 63.75,6.6 48.72,6.6 48.31,7.01 v48.11,7.01 47.5,7.01 47.09,7.42 44.86,7.42 44.45,7.01 41.6,7.01 41,6.4 25.76,6.4 25.35,6.81 v25.15,6.81 23.72,8.23 16.87,8.23 14.83,10.26 13.31,10.26 12.78,10.79 J9.5 | J9.5 12.7,10.82 | 17.12,16.66 16.05,16.66 12.8,13.41 12.8,11.02 J9.5 | 17.12,16.66 v17.83,16.66 | IC1.1 25.35,29.16 25.35,26.21 20.62,21.49 17.12,21.49 17.12,16.66
RESET  (via drill 0.38)
  Top 0.203: 78.84,24.38 78.44,24.38 78.11,24.05 R11.1 78.03,23.57 v74.42,23.57 | 78.84,24.38 79.45,24.38 80.06,23.77 80.96,23.77 RESET.A2 RESET.A 86.72,23.72 86.72,26.77 J8.3 | C12.2 79.35,31.5 79.35,32.21 79.15,32.41 78.33,32.41 78.03,32.11 78.03,28.65 78.84,27.84 78.84,24.38
  Bottom 0.203: IC1.9 45.72,25.09 47.85,22.96 73.81,22.96 v74.42,23.57
RX0
  Top 0.203: IC2.1 61.09,24.49 58.42,24.49 | 58.42,24.49 56.39,24.49 56.35,24.45 R10.2 | 58.42,24.49 IC1.14
RX1  (via drill 0.38)
  Top 0.203: v75.95,15.65 76.2,15.39 J12.3 | J11.3 53.19,10.95 v53.19,15.44 v54.3,16.56 | J10.3 30.23,11.05 v30.23,15.24 29.26,15.24 27.94,16.56 R15.1 | IC1.16 63.5,25.81 64.21,25.09 v64.21,21.39
  Bottom 0.203: v30.23,15.24 30.43,15.24 30.84,14.83 40.59,14.83 41.2,15.44 43.43,15.44 43.84,15.85 50.95,15.85 51.36,15.44 v53.19,15.44 53.39,15.44 53.8,15.04 63.35,15.04 63.96,15.65 66.19,15.65 66.6,16.05 73.71,16.05 74.12,15.65 v75.95,15.65 76.15,15.65 | IC1.16 63.5,30.58 64.92,32 66.85,32 68.17,33.33 68.17,39.93 66.55,41.55 63.7,41.55 62.28,42.98 62.28,46.74 63.5,47.95 J5.8 | v64.21,21.39 64.21,18.14 64.62,17.73 64.62,17.12 64.06,16.56 v54.3,16.56
SCK  (via drill 0.38)
  Top 0.203: v44.5,40.54 43.18,39.22 IC1.8 42.67,28.7 42.67,28.04 41.66,27.03 39.83,27.03 39.01,26.21 35.66,26.21 31.39,21.95 26.62,21.95 25.7,21.03 25.7,19.81 v26.11,19.41 | J12.7 65.79,11.05 v65.79,13.61 | J11.7 43.03,10.95 v43.03,13.41 | J10.7 20.68,11.15 v20.68,13.21
  Bottom 0.203: v65.79,13.61 64.36,13.61 64.16,13.41 v43.03,13.41 41.6,13.41 41.4,13.21 21.95,13.21 | v20.68,13.21 21.95,13.21 | J4.5 48.16,51.33 48.16,49.78 44.5,46.13 v44.5,40.54 | v26.11,19.41 25.4,19.41 24.38,18.39 24.38,17.17 21.95,14.73 21.95,13.21
SCL  (via drill 0.38)
  Top 0.203: IC1.22 70.61,43.94 70.61,43.28 69.6,42.27 54.86,42.27 50.9,38.3 50.9,32.92 v51.21,32.51 | v48.67,23.67 47.95,22.96 47.95,19.71 47.45,19.2 v47.45,18.59 47.27,18.41 U4.6 | 49.19,19.71 R17.1 | J13.2 32.87,3.33 v32.87,8.03 | J14.2 55.55,3.5 v55.55,8.23 | J15.2 78.59,3.33 v78.59,8.43 | v42.88,16.97 41.86,15.95 v41.86,8.74
  Top 0.406: 47.95,19.71 49.19,19.71
  Bottom 0.203: 41.86,8.23 41,8.23 40.39,7.62 33.27,7.62 v32.87,8.03 | 41.86,8.23 43.03,8.23 43.43,8.64 53.59,8.64 54,8.23 v55.55,8.23 56.24,7.82 63.14,7.82 63.75,8.43 65.79,8.43 66.19,8.84 76.35,8.84 76.76,8.43 v78.59,8.43 | v51.21,32.51 52.12,31.6 52.12,27.43 48.67,23.98 v48.67,23.67 | v42.88,16.97 44.5,18.59 v47.45,18.59 | 41.86,8.23 v41.86,8.74
SDA  (via drill 0.38)
  Top 0.203: IC1.23 68.17,44.04 68.17,43.28 67.56,42.67 54.56,42.67 49.58,37.69 v49.58,27.64 | v47.45,17.07 47.37,17.14 U4.5 43.89,17.14 43.43,17.6 43.43,18.75 43.74,19.05 46.48,19.05 46.74,19.3 46.74,20.02 47.45,20.73 v47.45,24.38 | R18.1 49.14,17.07 v47.45,17.07 | J13.3 30.23,3.43 v30.23,7.62 | J14.3 53.19,3.33 v53.19,7.82 53.14,7.82 52.43,8.53 45.31,8.53 44.5,9.35 44.5,15.14 45.21,15.85 46.23,15.85 v47.45,17.07 | J15.3 75.95,3.43 v75.95,8.03
  Bottom 0.203: v30.23,7.62 30.43,7.62 30.84,7.21 40.59,7.21 41.2,7.82 43.43,7.82 43.84,8.23 50.95,8.23 51.36,7.82 v53.19,7.82 53.39,7.82 53.8,7.42 63.35,7.42 63.96,8.03 66.19,8.03 66.6,8.43 73.71,8.43 74.12,8.03 v75.95,8.03 76.15,8.03 | v49.58,27.64 47.45,25.5 v47.45,24.38
SS  (via drill 0.38)
  Top 0.203: v36.78,40.44 35.56,39.22 IC1.5 34.95,28.6 34.95,27.84 30.38,23.27 25.81,23.27 24.49,21.95 24.49,16.15 25.09,15.54 26.11,15.54 26.82,14.83 v27.58,14.83 | v27.58,14.83 27.53,14.83 | J12.4 73.3,11.15 v73.3,15.24 | J11.4 50.55,11.05 v50.55,15.04 | J10.4 27.58,11.15 v27.58,14.83
  Bottom 0.203: v73.3,15.24 71.68,15.24 71.27,15.65 67,15.65 66.6,15.24 64.16,15.24 63.55,14.63 51.36,14.63 50.95,15.04 v50.55,15.04 48.92,15.04 48.51,15.44 44.25,15.44 43.84,15.04 41.4,15.04 40.79,14.43 28.4,14.43 27.99,14.83 v27.58,14.83 | J4.8 40.44,51.23 40.44,49.68 36.78,46.02 v36.78,40.44
TX0
  Top 0.203: IC1.15 60.96,27.74 63.8,24.89 63.8,22.55 63.2,21.95 IC2.5
TX1  (via drill 0.38)
  Top 0.203: v78.59,16.05 78.74,15.9 J12.2 | J11.2 55.55,11.12 v55.55,15.85 | J10.2 32.87,10.95 v32.87,15.65 32.11,15.65 31.09,16.66 31.09,17.44 R16.1 | v66.04,21.39 IC1.17
  Bottom 0.203: 66.09,16.36 65.79,16.05 63.75,16.05 63.14,15.44 56.24,15.44 v55.55,15.85 54,15.85 53.59,16.26 43.43,16.26 43.03,15.85 41,15.85 40.39,15.24 33.27,15.24 v32.87,15.65 | 66.09,16.36 66.19,16.46 76.35,16.46 76.76,16.05 v78.59,16.05 | IC1.17 66.04,30.79 66.55,31.29 66.95,31.29 68.58,32.92 68.58,40.13 66.55,42.16 65.63,42.16 64.82,42.98 64.82,46.74 66.04,47.95 J5.7 | v66.04,21.39 66.04,16.41 66.09,16.36
VCC  (via drill 0.38)
  Top 0.203: R16.2 31.09,19.39 31.09,20.52 30.99,20.62 28.25,20.62 | 28.25,20.62 27.94,20.32 R15.2 | v27.84,20.73 27.94,20.62 28.25,20.62 | 47.55,25.81 47.14,25.4 D4.A | R18.2 51.14,17.17 52.22,17.17 52.43,17.37 | R17.2 51.1,19.7 | 16,14.07 19.2,14.07 19.2,14.78 19.86,15.44 21.84,15.44 21.95,15.54 21.95,17.37 22.5,17.88 | R14.2 22.76,19.9 v22.76,17.98
  Top 0.406: IC1.30 50.6,44.25 50.6,42.37 48.26,40.03 IC1.10 48.26,25.81 | 48.26,25.81 47.55,25.81 | 48.26,25.81 49.77,25.81 C9.2 49.8,22.23 51.1,20.93 51.1,19.7 | R17.2 52.05,19.68 52.43,19.3 52.43,17.37 55.17,17.37 57.56,14.99 v57.56,12.7 | J14.8 J11.8 | 14.83,8.84 11.94,8.84 10.26,7.16 9.6,7.16 SW1.P$1 | 14.83,8.84 15.85,8.84 | 15.85,8.84 17.73,10.72 J10.8 | J13.8 17.78,6.86 15.95,8.69 15.85,8.84 | v79.6,21.39 78.13,21.39 R11.2 | v76.2,17.98 74.02,17.98 71.68,15.65 70.26,15.65 69.85,15.24 66.24,15.24 63.5,12.5 J12.8 J15.8 | R13.2 16,14.07 16,12.45 14.83,11.28 14.83,8.84 | 22.5,17.88 22.71,17.88 22.71,17.93 v22.76,17.98
  Bottom 0.203: v22.76,17.98 25.5,20.73 v27.84,20.73
  Bottom 0.406: J13.8 17.78,3.15 19.71,1.22 36.07,1.22 38,3.15 40.64,3.15 J14.8 40.79,3.05 42.62,1.22 61.57,1.22 63.5,3.15 J15.8 | v76.2,17.98 v79.6,21.39 | v57.56,12.7 57.86,12.7 57.91,12.75 61.57,12.75 63.5,10.82 J12.8
VCC_UNSW  (via drill 0.38)
  Top 0.406: J9.2 5.08,9.04 6.1,8.03 6.1,7 C14.2 6.83,6.99 8.64,5.18 9.86,5.18 10.36,5.69 11.68,5.69 12.09,6.1 12.09,7.11 SW1.P$2 | J9.2 5.18,10.97 | J9.2 5.08,13.51 8.18,16.61 9.65,16.61 T5.1 9.91,16.97 9.91,18.39 v11.58,20.07 | v14.28,35.41 T2.2
  Bottom 0.406: v14.28,35.41 11.58,32.72 v11.58,20.07
VCOM  (via drill 0.38)
  Top 0.203: J13.6 22.71,3.33 v22.71,6.4 | J14.6 45.67,3.23 v45.67,6.6 | J15.6 68.43,3.33 v68.43,6.81
  Top 0.406: J13.6 22.76,3.15 20.83,1.22 17.27,1.22 15.8,2.69 6.3,2.69 1.37,7.62 v1.37,7.82 | 9.65,35.41 9.65,34.85 7.72,34.85 7.32,34.44 7.32,34.29 R3.1 7.26,34.65 7.06,34.85 7.06,36.27 2.69,36.27 | 9.65,35.41 9.65,36.27 T1.2 | 2.69,36.27 2.13,36.83 2.13,38.71 D2.C | R9.2 T4.2 21.79,30.89 21.79,40.69 21.39,41.1 19.46,41.1 C1.+ 19.46,41.3 17.58,41.3 16.97,40.69 | 16.97,40.69 16.97,38.1 R6.2 16.76,38 v15.54,38 | 9.65,35.41 v9.75,35.41 | v2.59,36.12 2.69,36.27 | D1.C 7.42,52.43 7.42,51.31 7.92,50.29 14.12,50.29 16.87,47.55 16.97,47.45 16.97,40.69
  Bottom 0.203: v22.71,6.4 23.52,6.4 23.93,5.99 41.2,5.99 41.81,6.6 v45.67,6.6 46.48,6.6 46.89,6.2 63.96,6.2 64.57,6.81 v68.43,6.81
  Bottom 0.406: v9.75,35.41 12.24,35.41 14.83,38 v15.54,38 | v2.59,36.12 1.47,35 1.47,12.19 1.37,12.19 v1.37,7.82
VIN+
  Top 0.203: J1.P$1 7.57,47.9 | 12.55,47.9 J1.P$2
  Top 0.813: 7.57,47.9 12.55,47.9
  Bottom 0.203: J1.P$2 12.55,47.9
  Bottom 0.813: 12.55,47.9 11.48,46.84 11.07,46.84 10.16,45.92 J6.2
VIN-
  Top 0.203: 7.57,45.41 J2.P$1 7.47,45.36 | J2.P$2
  Top 0.813: 7.57,45.41 J2.P$2 | 7.47,45.36 7.16,45.06 5.08,45.06 J6.4
VREGIN
  Top 0.406: T2.1 13.31,38.61 13.16,38.76 13.16,40.79 12.7,41.25 J6.1
VREGOUT
  Top 0.406: 12.8,20.12 12.04,19.36 12.04,17.93 T5.2 11.79,17.58 10.97,17.58 10.97,15.14 9.25,15.14 7.62,13.51 J9.3 | 12.8,20.12 15.19,22.5 17.12,22.5 C7.2 17.32,22.66 19.36,22.66 19.36,25.2 U3.2 | U2.7 10.41,24.13 10.46,24.18 11.58,24.18 12.8,22.96 12.8,20.12
VUNREG
  Top 0.406: T1.1 8.84,38.51 8.84,39.12 7.62,40.34 J6.3
VUSB  (via drill 0.38)
  Top 0.203: R7.2 77.93,38.73 77.93,38.2 76.81,37.08 76.81,33.02 77.01,32.82 | R20.2 86.67,16.62 86.67,17.48 86.36,17.78 84.53,17.78 | 84.53,17.78 78.23,17.78 76.2,19.81 73.97,19.81 72.34,19.81 | 69.7,19.41 69.49,19.2 | 69.49,18.69 69.49,18.7 | 68.46,19.41 IC2.20 | R19.2 84.53,16.65 84.53,17.78
  Top 0.305: 69.49,19.2 69.49,18.69 | 69.49,18.7 IC2.19 | 68.46,19.41 69.7,19.41 70.92,19.41 71.32,19.81 72.34,19.81 72.34,21.17 C11.2
  Top 0.406: F1.1 78.11,33.2 77.72,32.82 77.01,32.82 76.91,32.66 v76.91,24.38 | v73.97,21.44 73.97,19.81 | D2.A 5.99,38.81 6.81,38.81 7.9,37.72 7.9,37.34 | 7.9,37.34 T1.3 | T2.3 12.34,36.47 12.14,36.68 10.67,36.68 10.67,37.34 v8.99,37.34 7.9,37.34 | J9.4 10.16,13.51 10.21,13.56 11.02,13.56 11.68,14.22 11.68,15.65 T5.3 11.94,16 12.9,16 v12.9,16.31 | v15.04,17.27 15.9,17.27 16.05,17.42 T6.3
  Bottom 0.406: v76.91,24.38 v73.97,21.44 73.81,21.54 72.19,21.54 71.27,22.45 47.6,22.45 44.2,25.86 44.2,26.21 41.91,27.99 41.91,30.02 41.63,30.61 | 41.63,30.61 41.4,30.94 | v15.04,17.27 14.07,16.31 v12.9,16.31 12.8,16.46 10.77,18.49 10.77,32.61 10.54,32.84 | v8.99,37.34 8.94,37.34 8.94,34.44 10.54,32.84 | 10.54,32.84 13.92,36.22 41.45,36.22 41.45,30.84 41.63,30.61
VUSB_RAW
  Top 0.406: J7.1 81.52,37.08 79.25,37.08 79.05,37.29 78.33,37.29 78.11,37.06 F1.2

### Text on the board
tPlace: + | - | ON
tNames: 5 | 4 | 3 | 2 | 7 | 6 | 23 | 22 | 21 | 20 | 19 | 18 | 17 | 16 | Rx1 | Tx1 | 9 | 8 | 5 | 4 | 3 | 2 | 1 | 0 | SS | 11 | 10 | SCK | MOSI | MISO | Mosquino Aedes rev4 | 20111023/Drmn4ea | PFULL | VCC_US | VREGOUT | VUSB | PGOOD | Vcc | SCK | MOSI | MISO | SS | Rx1 | Tx1 | Gnd | 2 | 3 | 1 | Vcc | AREF | VCOM | PGOOD | PFULL | SDA | SCL | Gnd
bNames: 10 | SS# | MOSI | MISO | SCK | 11 | 9 | 8 | 5 | 4 | 3 | 2 | 1 | 0 | +Vin | 23 | 22 | 21 | 20 | 19 | 18 | 17 | 16 | Rx1 | Tx1 | -Vin | GND | VIN- | VUNREG | VIN+ | VREG | Rx1/INT0 | Tx1/INT1 | Rx1/INT0 | Tx1/INT1 | Rx1/INT0 | Tx1/INT1 | PGOOD# | MOSI | MISO | MOSI | MISO | MOSI | MISO | Vcc | SCK | SS# | Gnd | Vcc | SCK | SS# | Gnd | Vcc | SCK | SS# | Gnd | PFULL# | VCC_UNSW | VREGOUT | VUSB | Vcc | AREF | VCOM | PGOOD | PFULL | SDA | SCL | Gnd | Vcc | AREF | VCOM | PGOOD | PFULL | SDA | SCL | Gnd | Vcc | AREF | VCOM | PGOOD | PFULL | SDA | SCL | Gnd